# EAGLE schematic memory-smd (EAGLE 5.11)
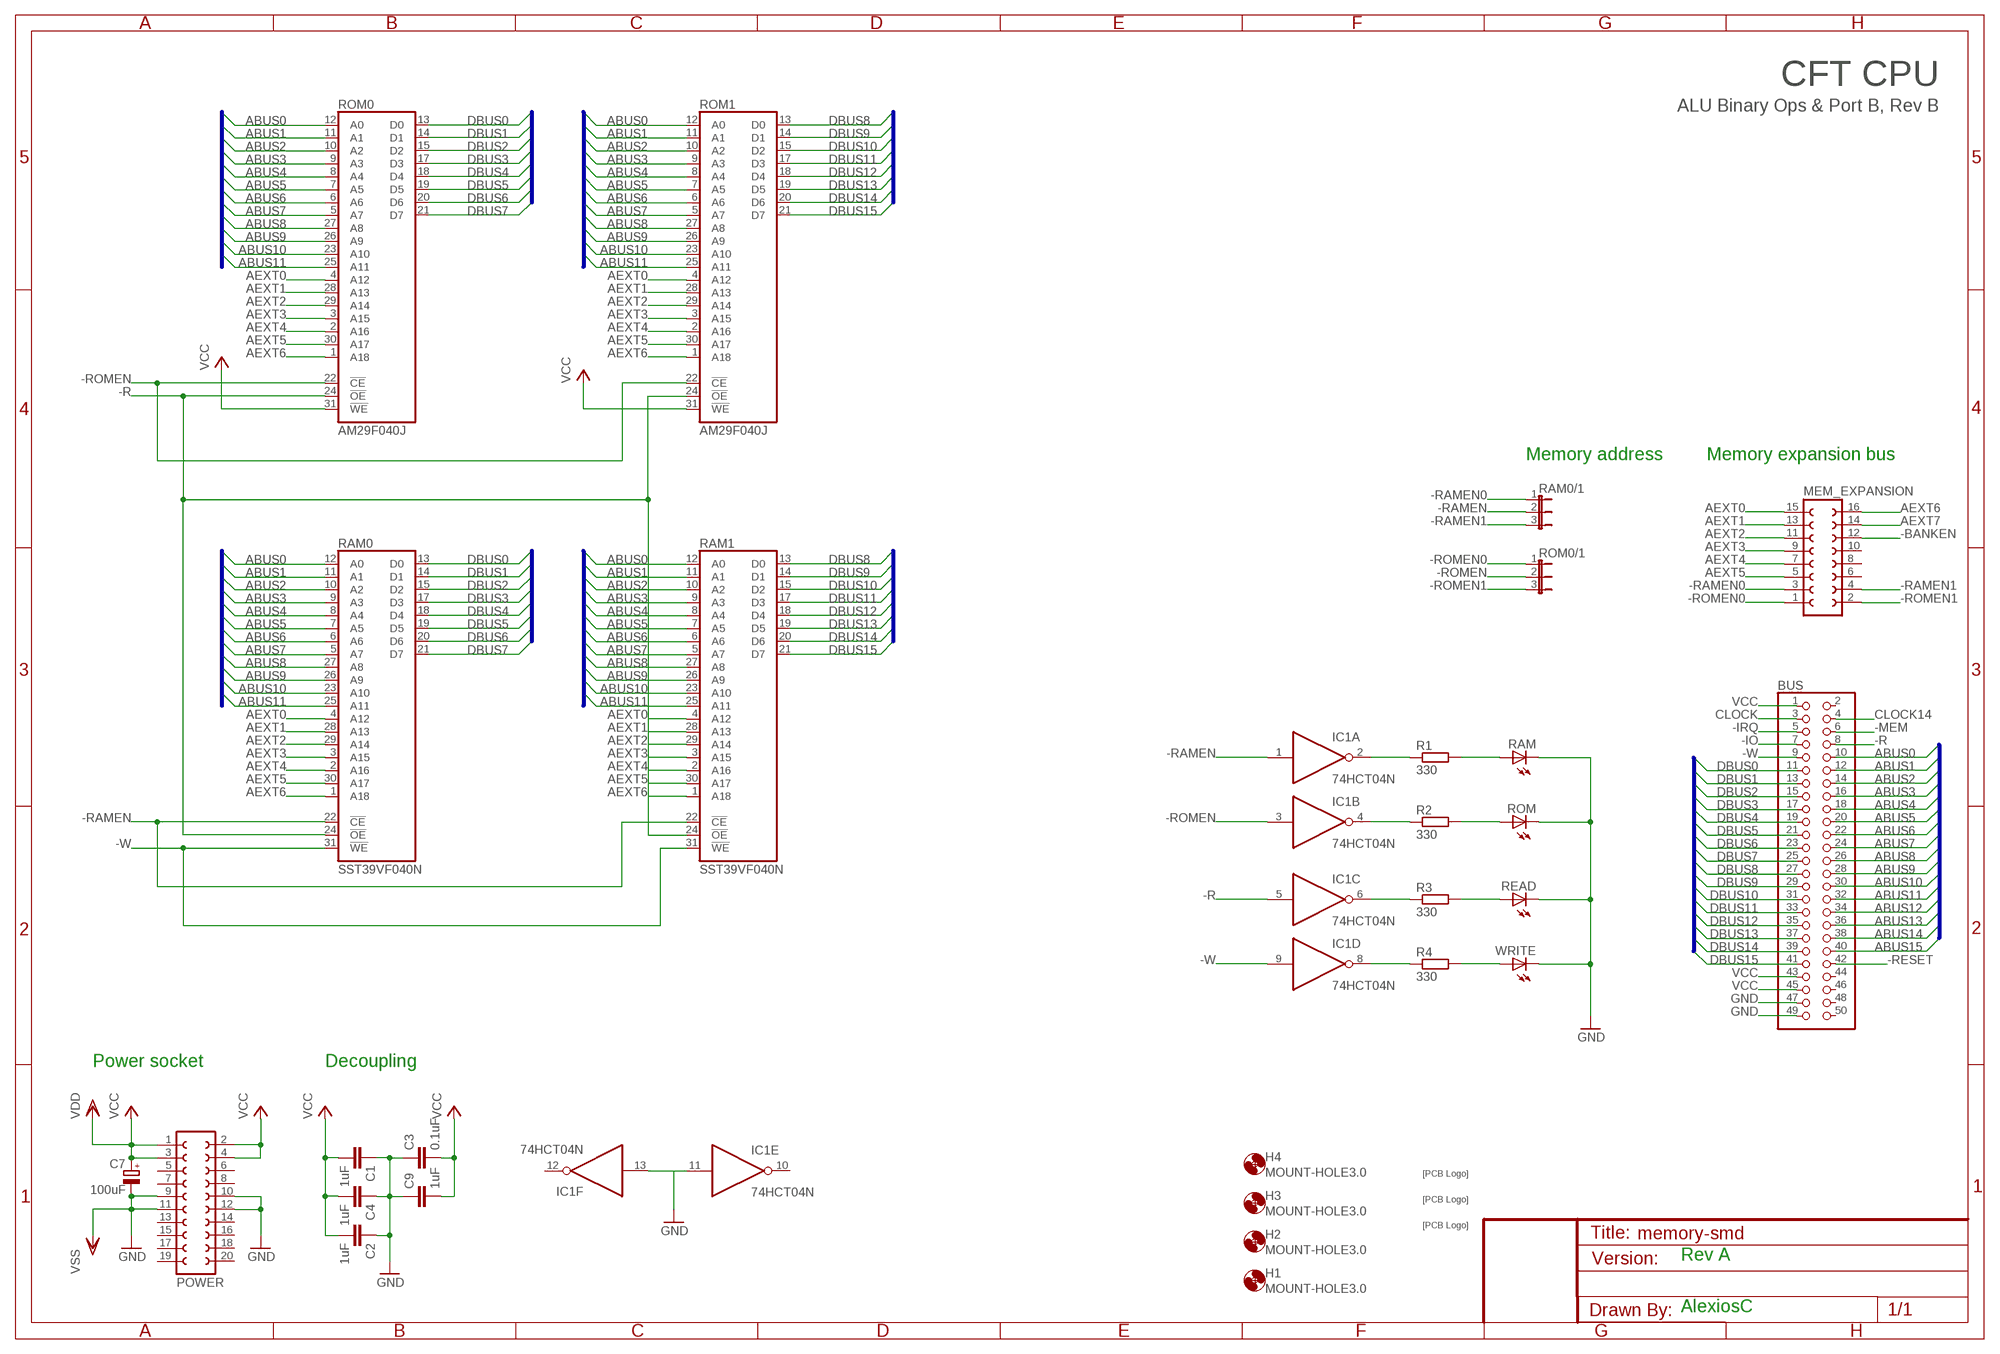
[diagram p0: schematic, sheet 1]

## Parts
BUS  PINHD-2X25  [2X25]
C1  1uF  C-EU025-025X050  [C025-025X050]
C2  1uF  C-EU025-025X050  [C025-025X050]
C3  0.1uF  C-EU025-025X050  [C025-025X050]
C4  1uF  C-EU025-025X050  [C025-025X050]
C7  100uF  CPOL-EUE2.5-6  [E2,5-6]
C9  1uF  C-EU025-025X050  [C025-025X050]
H1  MOUNT-HOLE3.0  [3,0]
H2  MOUNT-HOLE3.0  [3,0]
H3  MOUNT-HOLE3.0  [3,0]
H4  MOUNT-HOLE3.0  [3,0]
IC1  74HCT04N  [DIL14]
MEM_EXPANSION  FE08-2  [FE08-2]
POWER  FE10-2  [FE10-2]
R1  330  R-EU_0204/7  [0204/7]
R2  330  R-EU_0204/7  [0204/7]
R3  330  R-EU_0204/7  [0204/7]
R4  330  R-EU_0204/7  [0204/7]
RAM  LEDIRL80A  [IRL80A]
RAM0  SST39VF040N  [PLCC32R]
RAM0/1  JP2W  [JP2W]
RAM1  SST39VF040N  [PLCC32R]
READ  LEDIRL80A  [IRL80A]
ROM  LEDIRL80A  [IRL80A]
ROM0  AM29F040J  [PLCC32R]
ROM0/1  JP2W  [JP2W]
ROM1  AM29F040J  [PLCC32R]
U$1  SIGNATUREPLANE  [SIGNATURE_PLANE]
U$2  SIGNATUREPLANE  [SIGNATURE_PLANE]
U$3  SIGNATURESILK  [SIGNATURE]
WRITE  LEDIRL80A  [IRL80A]

## Nets
-BANKEN: MEM_EXPANSION.12
-IO: BUS.7
-IRQ: BUS.5
-MEM: BUS.6
-R: BUS.8 IC1.5(C:I) RAM0.24(!OE) RAM1.24(!OE) ROM0.24(!OE) ROM1.24(!OE)
-RAMEN: IC1.1(A:I) RAM0.22(!CE) RAM0/1.2 RAM1.22(!CE)
-RAMEN0: MEM_EXPANSION.3 RAM0/1.1
-RAMEN1: MEM_EXPANSION.4 RAM0/1.3
-RESET: BUS.42
-ROMEN: IC1.3(B:I) ROM0.22(!CE) ROM0/1.2 ROM1.22(!CE)
-ROMEN0: MEM_EXPANSION.1 ROM0/1.1
-ROMEN1: MEM_EXPANSION.2 ROM0/1.3
-W: BUS.9 IC1.9(D:I) RAM0.31(!WE) RAM1.31(!WE)
ABUS0: BUS.10 RAM0.12(A0) RAM1.12(A0) ROM0.12(A0) ROM1.12(A0)
ABUS1: BUS.12 RAM0.11(A1) RAM1.11(A1) ROM0.11(A1) ROM1.11(A1)
ABUS2: BUS.14 RAM0.10(A2) RAM1.10(A2) ROM0.10(A2) ROM1.10(A2)
ABUS3: BUS.16 RAM0.9(A3) RAM1.9(A3) ROM0.9(A3) ROM1.9(A3)
ABUS4: BUS.18 RAM0.8(A4) RAM1.8(A4) ROM0.8(A4) ROM1.8(A4)
ABUS5: BUS.20 RAM0.7(A5) RAM1.7(A5) ROM0.7(A5) ROM1.7(A5)
ABUS6: BUS.22 RAM0.6(A6) RAM1.6(A6) ROM0.6(A6) ROM1.6(A6)
ABUS7: BUS.24 RAM0.5(A7) RAM1.5(A7) ROM0.5(A7) ROM1.5(A7)
ABUS8: BUS.26 RAM0.27(A8) RAM1.27(A8) ROM0.27(A8) ROM1.27(A8)
ABUS9: BUS.28 RAM0.26(A9) RAM1.26(A9) ROM0.26(A9) ROM1.26(A9)
ABUS10: BUS.30 RAM0.23(A10) RAM1.23(A10) ROM0.23(A10) ROM1.23(A10)
ABUS11: BUS.32 RAM0.25(A11) RAM1.25(A11) ROM0.25(A11) ROM1.25(A11)
ABUS12: BUS.34
ABUS13: BUS.36
ABUS14: BUS.38
ABUS15: BUS.40
AEXT0: MEM_EXPANSION.15 RAM0.4(A12) RAM1.4(A12) ROM0.4(A12) ROM1.4(A12)
AEXT1: MEM_EXPANSION.13 RAM0.28(A13) RAM1.28(A13) ROM0.28(A13) ROM1.28(A13)
AEXT2: MEM_EXPANSION.11 RAM0.29(A14) RAM1.29(A14) ROM0.29(A14) ROM1.29(A14)
AEXT3: MEM_EXPANSION.9 RAM0.3(A15) RAM1.3(A15) ROM0.3(A15) ROM1.3(A15)
AEXT4: MEM_EXPANSION.7 RAM0.2(A16) RAM1.2(A16) ROM0.2(A16) ROM1.2(A16)
AEXT5: MEM_EXPANSION.5 RAM0.30(A17) RAM1.30(A17) ROM0.30(A17) ROM1.30(A17)
AEXT6: MEM_EXPANSION.16 RAM0.1(A18) RAM1.1(A18) ROM0.1(A18) ROM1.1(A18)
AEXT7: MEM_EXPANSION.14
CLOCK: BUS.3
CLOCK14: BUS.4
DBUS0: BUS.11 RAM0.13(D0) ROM0.13(D0)
DBUS1: BUS.13 RAM0.14(D1) ROM0.14(D1)
DBUS2: BUS.15 RAM0.15(D2) ROM0.15(D2)
DBUS3: BUS.17 RAM0.17(D3) ROM0.17(D3)
DBUS4: BUS.19 RAM0.18(D4) ROM0.18(D4)
DBUS5: BUS.21 RAM0.19(D5) ROM0.19(D5)
DBUS6: BUS.23 RAM0.20(D6) ROM0.20(D6)
DBUS7: BUS.25 RAM0.21(D7) ROM0.21(D7)
DBUS8: BUS.27 RAM1.13(D0) ROM1.13(D0)
DBUS9: BUS.29 RAM1.14(D1) ROM1.14(D1)
DBUS10: BUS.31 RAM1.15(D2) ROM1.15(D2)
DBUS11: BUS.33 RAM1.17(D3) ROM1.17(D3)
DBUS12: BUS.35 RAM1.18(D4) ROM1.18(D4)
DBUS13: BUS.37 RAM1.19(D5) ROM1.19(D5)
DBUS14: BUS.39 RAM1.20(D6) ROM1.20(D6)
DBUS15: BUS.41 RAM1.21(D7) ROM1.21(D7)
GND: BUS.47 BUS.49 C1.1 C2.1 C3.1 C4.1 C7.- C9.1 IC1.11(E:I) IC1.13(F:I) POWER.9 POWER.10 POWER.11 POWER.12 RAM.K(C) READ.K(C) ROM.K(C) WRITE.K(C) ; supply symbol labelled VSS
N$1: R1.2 RAM.A
N$2: IC1.2(A:O) R1.1
N$3: R2.2 ROM.A
N$4: IC1.4(B:O) R2.1
N$5: R3.2 READ.A
N$6: IC1.6(C:O) R3.1
N$7: R4.2 WRITE.A
N$8: IC1.8(D:O) R4.1
VCC: BUS.1 BUS.43 BUS.45 C1.2 C2.2 C3.2 C4.2 C7.+ C9.2 POWER.1 POWER.2 POWER.3 POWER.4 ROM0.31(!WE) ROM1.31(!WE) ; supply symbol labelled VDD
Unconnected: BUS.2 BUS.44 BUS.46 BUS.48 BUS.50 IC1.10(E:O) IC1.12(F:O) MEM_EXPANSION.6 MEM_EXPANSION.8 MEM_EXPANSION.10 POWER.5 POWER.6 POWER.7 POWER.8 POWER.13 POWER.14 POWER.15 POWER.16 POWER.17 POWER.18 POWER.19 POWER.20

## Buses
ABUS[0..15]
DBUS[0..15]

## Notes on the sheet
- CFT CPU
- ALU Binary Ops & Port B, Rev B
- Memory address | Memory expansion bus
- Power socket | Decoupling
- Rev A
- AlexiosC

## Power pins joined to a net without a drawn wire
GND: IC1.7(P:GND) RAM0.16(GND) RAM1.16(GND) ROM0.16(GND) ROM1.16(GND)
VCC: IC1.14(P:VCC) RAM0.32(VCC) RAM1.32(VCC) ROM0.32(VCC) ROM1.32(VCC)

## Library data of the parts
BUS = pinhead:PINHD-2X25: PIN HEADER
C1-C4 C9 = rcl:C-EU: CAPACITOR, European symbol
C7 = rcl:CPOL-EU: POLARIZED CAPACITOR, European symbol
H1-H4 = holes:MOUNT-HOLE: MOUNTING HOLE with drill center marker
IC1 = 74xx-eu:74*04: Hex INVERTER
MEM_EXPANSION = con-lsta:FE08-2: FEMALE HEADER; OC_FARNELL: unknown; OC_NEWARK: unknown
POWER = con-lsta:FE10-2: FEMALE HEADER; OC_FARNELL: unknown; OC_NEWARK: unknown
R1-R4 = rcl:R-EU_: RESISTOR, European symbol
RAM READ ROM WRITE = led:LED: LED OSRAM: - CHIPLED LG R971, LG N971, LY N971, LG Q971, LY Q971, LO R971, LY R971 LH N974, LH R974 LS Q976, LO Q976, LY Q976 LO Q996 - Hyper CHIPLED LW Q18S LB Q993, LB Q99A, LB R99A - SideLED LS A670, LO A670, LY A670, LG A670, LP A670 LB A673, LV A673, LT A673, LW A673 LH A674 LY A675 LS A676, LA A676, LO A676, LY A676, LW A676 LS A679, LY A679, LG A679 - Hyper Micro SIDELED® LS Y876, LA Y876, LO Y876, LY Y876 LT Y87S - SmartLED LW L88C, LW L88S LB L89C, LB L89S, LG L890 LS L89K, LO L89K, LY L89K LS L896, LA L896, LO L896, LY L896 - TOPLED LS T670, LO T670, LY T670, LG T670, LP T670 LSG T670, LSP T670, LSY T670, LOP T670, LYG T670 LG T671, LOG T671, LSG T671 LB T673, LV T673, LT T673, LW T673 LH T674 LS T676, LA T676, LO T676, LY T676, LB T676, LH T676, LSB T676, LW T676 LB T67C, LV T67C, LT T67C, LS T67K, LO T67K, LY T67K, LW E67C LS E67B, LA E67B, LO E67B, LY E67B, LB E67C, LV E67C, LT E67C LW T67C LS T679, LY T679, LG T679 LS T770, LO T770, LY T770, LG T770, LP T770 LB T773, LV T773, LT T773, LW T773 LH T774 LS E675, LA E675, LY E675, LS T675 LS T776, LA T776, LO T776, LY T776, LB T776 LHGB T686 LT T68C, LB T68C - Hyper Mini TOPLED® LB M676 - Mini TOPLED Santana® LG M470 LS M47K, LO M47K, LY M47K Source: http://www.osram.convergy.de LUXEON: - LUMILED® LXK2-PW12-R00, LXK2-PW12-S00, LXK2-PW14-U00, LXK2-PW14-V00 LXK2-PM12-R00, LXK2-PM12-S00, LXK2-PM14-U00 LXK2-PE12-Q00, LXK2-PE12-R00, LXK2-PE12-S00, LXK2-PE14-T00, LXK2-PE14-U00 LXK2-PB12-K00, LXK2-PB12-L00, LXK2-PB12-M00, LXK2-PB14-N00, LXK2-PB14-P00, LXK2-PB14-Q00 LXK2-PR12-L00, LXK2-PR12-M00, LXK2-PR14-Q00, LXK2-PR14-R00 LXK2-PD12-Q00, LXK2-PD12-R00, LXK2-PD12-S00 LXK2-PH12-R00, LXK2-PH12-S00 LXK2-PL12-P00, LXK2-PL12-Q00, LXK2-PL12-R00 Source: www.luxeon.com KINGBRIGHT: KA-3528ASYC Source: www.kingbright.com
RAM0 RAM1 = memory:SST39VF040: 4 Mbit x8 Multi-Purpose Flash Source: http://www.sst.com/dotAsset/40782.pdf
RAM0/1 ROM0/1 = jumper:JP2W: JUMPER
ROM0 ROM1 = am29-memory:AM29F040J: 4-Megabit FLASH MEMORY (512 K x 8 bit) 5 V-only
U$1-U$3 = alexios:SIGNATURE: Soup signature

## Net classes
0 default: width 0.406 mm, clearance 0.305 mm
1 Decoupling: width 1.27 mm